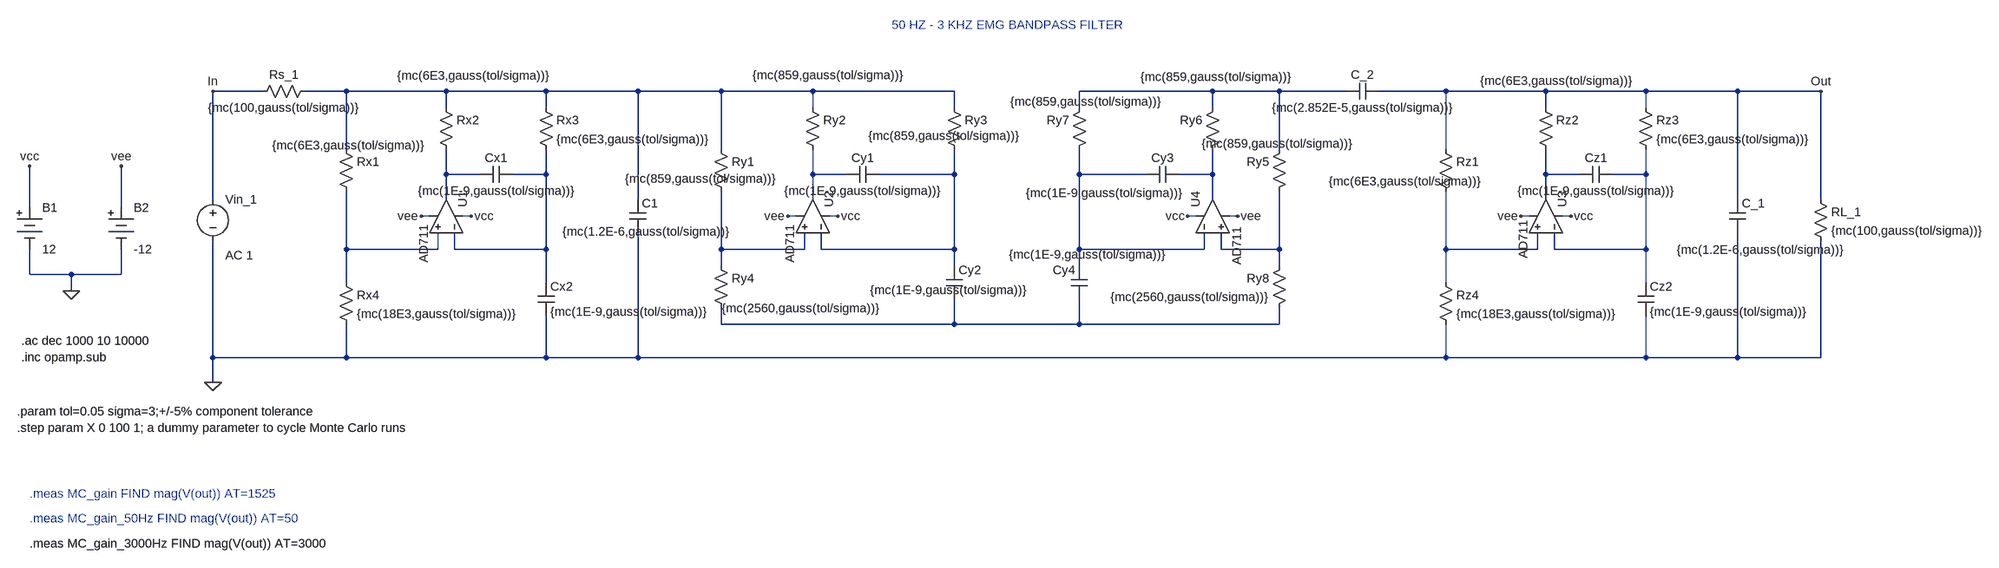
[diagram p0: schematic MC_FEMG.asc]
MC_FEMG.asc, the LTspice schematic file:
Version 4.1
SHEET 1 2276 824
WIRE -1072 -128 -1168 -128
WIRE -912 -128 -992 -128
WIRE -720 -128 -912 -128
WIRE -528 -128 -720 -128
WIRE -352 -128 -528 -128
WIRE -192 -128 -352 -128
WIRE -16 -128 -192 -128
WIRE 256 -128 -16 -128
WIRE 752 -128 496 -128
WIRE 880 -128 752 -128
WIRE 1008 -128 880 -128
WIRE 1200 -128 1072 -128
WIRE 1392 -128 1200 -128
WIRE 1584 -128 1392 -128
WIRE 1760 -128 1584 -128
WIRE 1920 -128 1760 -128
WIRE -720 -96 -720 -128
WIRE -528 -96 -528 -128
WIRE -16 -96 -16 -128
WIRE 256 -96 256 -128
WIRE 496 -96 496 -128
WIRE 752 -96 752 -128
WIRE 1392 -96 1392 -128
WIRE 1584 -96 1584 -128
WIRE -912 -16 -912 -128
WIRE -192 -16 -192 -128
WIRE 880 -16 880 -128
WIRE 1200 -16 1200 -128
WIRE -720 32 -720 -16
WIRE -656 32 -720 32
WIRE -528 32 -528 -16
WIRE -528 32 -592 32
WIRE -16 32 -16 -16
WIRE 48 32 -16 32
WIRE 256 32 256 -16
WIRE 256 32 112 32
WIRE 496 32 496 -16
WIRE 624 32 496 32
WIRE 752 32 752 -16
WIRE 752 32 688 32
WIRE 1392 32 1392 -16
WIRE 1456 32 1392 32
WIRE 1584 32 1584 -16
WIRE 1584 32 1520 32
WIRE -1168 80 -1168 -128
WIRE -720 80 -720 32
WIRE -352 80 -352 -128
WIRE -16 80 -16 32
WIRE 752 80 752 32
WIRE 1392 80 1392 32
WIRE 1760 80 1760 -128
WIRE 1920 80 1920 -128
WIRE -1520 96 -1520 16
WIRE -1344 96 -1344 16
WIRE -752 112 -768 112
WIRE -672 112 -688 112
WIRE -48 112 -64 112
WIRE 32 112 16 112
WIRE 720 112 704 112
WIRE 800 112 784 112
WIRE 1360 112 1344 112
WIRE 1440 112 1424 112
WIRE -912 176 -912 64
WIRE -736 176 -736 144
WIRE -736 176 -912 176
WIRE -704 176 -704 144
WIRE -528 176 -528 32
WIRE -528 176 -704 176
WIRE -192 176 -192 64
WIRE -32 176 -32 144
WIRE -32 176 -192 176
WIRE 0 176 0 144
WIRE 256 176 256 32
WIRE 256 176 0 176
WIRE 496 176 496 32
WIRE 736 176 736 144
WIRE 736 176 496 176
WIRE 768 176 768 144
WIRE 880 176 880 64
WIRE 880 176 768 176
WIRE 1200 176 1200 64
WIRE 1376 176 1376 144
WIRE 1376 176 1200 176
WIRE 1408 176 1408 144
WIRE 1584 176 1584 32
WIRE 1584 176 1408 176
WIRE -192 208 -192 176
WIRE 256 208 256 176
WIRE 496 208 496 176
WIRE 880 208 880 176
WIRE -1520 224 -1520 176
WIRE -1440 224 -1520 224
WIRE -1344 224 -1344 176
WIRE -1344 224 -1440 224
WIRE -912 240 -912 176
WIRE -528 240 -528 176
WIRE 1200 240 1200 176
WIRE 1584 240 1584 176
WIRE -1440 256 -1440 224
WIRE -192 320 -192 288
WIRE 256 320 256 272
WIRE 256 320 -192 320
WIRE 496 320 496 272
WIRE 496 320 256 320
WIRE 880 320 880 288
WIRE 880 320 496 320
WIRE -1168 384 -1168 160
WIRE -912 384 -912 320
WIRE -912 384 -1168 384
WIRE -528 384 -528 304
WIRE -528 384 -912 384
WIRE -352 384 -352 144
WIRE -352 384 -528 384
WIRE 1200 384 1200 320
WIRE 1200 384 -352 384
WIRE 1584 384 1584 304
WIRE 1584 384 1200 384
WIRE 1760 384 1760 144
WIRE 1760 384 1584 384
WIRE 1920 384 1920 160
WIRE 1920 384 1760 384
WIRE -1168 432 -1168 384
FLAG -1168 432 0
FLAG -1440 256 0
FLAG -1520 16 vcc
FLAG -1344 16 vee
FLAG -768 112 vee
FLAG -64 112 vee
FLAG 800 112 vee
FLAG 1344 112 vee
FLAG -672 112 vcc
FLAG 32 112 vcc
FLAG 704 112 vcc
FLAG 1440 112 vcc
FLAG -1168 -128 In
FLAG 1920 -128 Out
SYMBOL voltage -1168 64 R0
WINDOW 123 24 124 Left 2
WINDOW 39 0 0 Left 0
SYMATTR Value2 AC 1
SYMATTR InstName Vin_1
SYMATTR Value ""
SYMBOL res -976 -144 R90
WINDOW 0 0 56 VBottom 2
WINDOW 3 32 56 VTop 2
SYMATTR InstName Rs_1
SYMATTR Value {mc(100,gauss(tol/sigma))}
SYMBOL res -928 -32 R0
WINDOW 3 -126 8 Left 2
SYMATTR Value {mc(6E3,gauss(tol/sigma))}
SYMATTR InstName Rx1
SYMBOL res -736 -112 R0
WINDOW 3 -78 -46 Left 2
SYMATTR Value {mc(6E3,gauss(tol/sigma))}
SYMATTR InstName Rx2
SYMBOL res -544 -112 R0
SYMATTR InstName Rx3
SYMATTR Value {mc(6E3,gauss(tol/sigma))}
SYMBOL cap -592 16 R90
WINDOW 0 0 32 VBottom 2
WINDOW 3 32 32 VTop 2
SYMATTR InstName Cx1
SYMATTR Value {mc(1E-9,gauss(tol/sigma))}
SYMBOL res -928 224 R0
SYMATTR InstName Rx4
SYMATTR Value {mc(18E3,gauss(tol/sigma))}
SYMBOL cap -544 240 R0
SYMATTR InstName Cx2
SYMATTR Value {mc(1E-9,gauss(tol/sigma))}
SYMBOL cap -368 80 R0
WINDOW 3 -129 62 Left 2
SYMATTR Value {mc(1.2E-6,gauss(tol/sigma))}
SYMATTR InstName C1
SYMBOL res -208 -32 R0
WINDOW 3 -169 72 Left 2
SYMATTR Value {mc(859,gauss(tol/sigma))}
SYMATTR InstName Ry1
SYMBOL res -32 -112 R0
WINDOW 3 -100 -47 Left 2
SYMATTR Value {mc(859,gauss(tol/sigma))}
SYMATTR InstName Ry2
SYMBOL res 240 -112 R0
WINDOW 3 -149 70 Left 2
SYMATTR Value {mc(859,gauss(tol/sigma))}
SYMATTR InstName Ry3
SYMBOL cap 112 16 R90
WINDOW 0 0 32 VBottom 2
WINDOW 3 32 32 VTop 2
SYMATTR InstName Cy1
SYMATTR Value {mc(1E-9,gauss(tol/sigma))}
SYMBOL res -208 192 R0
WINDOW 3 17 97 Left 2
SYMATTR Value {mc(2560,gauss(tol/sigma))}
SYMATTR InstName Ry4
SYMBOL cap 240 208 R0
WINDOW 3 -146 46 Left 2
SYMATTR Value {mc(1E-9,gauss(tol/sigma))}
SYMATTR InstName Cy2
SYMBOL res 896 -32 M0
WINDOW 3 -125 5 Left 2
SYMATTR Value {mc(859,gauss(tol/sigma))}
SYMATTR InstName Ry5
SYMBOL res 768 -112 M0
WINDOW 3 -136 -44 Left 2
SYMATTR Value {mc(859,gauss(tol/sigma))}
SYMATTR InstName Ry6
SYMBOL res 512 -112 M0
WINDOW 3 -142 4 Left 2
SYMATTR Value {mc(859,gauss(tol/sigma))}
SYMATTR InstName Ry7
SYMBOL cap 624 16 M90
WINDOW 0 0 32 VBottom 2
WINDOW 3 36 -80 VTop 2
SYMATTR InstName Cy3
SYMATTR Value {mc(1E-9,gauss(tol/sigma))}
SYMBOL res 896 192 M0
SYMATTR InstName Ry8
SYMATTR Value {mc(2560,gauss(tol/sigma))}
SYMBOL cap 512 208 M0
WINDOW 3 -150 -22 Left 2
SYMATTR Value {mc(1E-9,gauss(tol/sigma))}
SYMATTR InstName Cy4
SYMBOL res 1184 -32 R0
WINDOW 3 -209 77 Left 2
SYMATTR Value {mc(6E3,gauss(tol/sigma))}
SYMATTR InstName Rz1
SYMBOL res 1376 -112 R0
WINDOW 3 -110 -36 Left 2
SYMATTR Value {mc(6E3,gauss(tol/sigma))}
SYMATTR InstName Rz2
SYMBOL res 1568 -112 R0
SYMATTR InstName Rz3
SYMATTR Value {mc(6E3,gauss(tol/sigma))}
SYMBOL cap 1520 16 R90
WINDOW 0 0 32 VBottom 2
WINDOW 3 32 32 VTop 2
SYMATTR InstName Cz1
SYMATTR Value {mc(1E-9,gauss(tol/sigma))}
SYMBOL res 1184 224 R0
SYMATTR InstName Rz4
SYMATTR Value {mc(18E3,gauss(tol/sigma))}
SYMBOL cap 1568 240 R0
SYMATTR InstName Cz2
SYMATTR Value {mc(1E-9,gauss(tol/sigma))}
SYMBOL cap 1744 80 R0
WINDOW 3 -101 97 Left 2
SYMATTR Value {mc(1.2E-6,gauss(tol/sigma))}
SYMATTR InstName C_1
SYMBOL cap 1072 -144 R90
WINDOW 0 0 32 VBottom 2
WINDOW 3 32 32 VTop 2
SYMATTR InstName C_2
SYMATTR Value {mc(2.852E-5,gauss(tol/sigma))}
SYMBOL res 1904 64 R0
SYMATTR InstName RL_1
SYMATTR Value {mc(100,gauss(tol/sigma))}
SYMBOL OpAmps\\AD711 -656 112 M270
WINDOW 3 -90 107 Left 2
SYMATTR InstName U1
SYMBOL OpAmps\\AD711 48 112 M270
WINDOW 3 -90 107 Left 2
SYMATTR InstName U2
SYMBOL OpAmps\\AD711 1456 112 M270
WINDOW 3 -82 107 Left 2
SYMATTR InstName U3
SYMBOL OpAmps\\AD711 688 112 R270
WINDOW 3 -94 111 Left 2
SYMATTR InstName U4
SYMBOL Misc\\battery -1520 80 R0
SYMATTR InstName B1
SYMATTR Value 12
SYMBOL Misc\\battery -1344 80 R0
SYMATTR InstName B2
SYMATTR Value -12
TEXT 136 -256 Left 2 ;50 HZ - 3 KHZ EMG BANDPASS FILTER
TEXT -1536 352 Left 2 !.ac dec 1000 10 10000\n.inc opamp.sub
TEXT -1544 488 Left 2 !.param tol=0.05 sigma=3;+/-5% component tolerance\n.step param X 0 100 1; a dummy parameter to cycle Monte Carlo runs
TEXT -1520 664 Left 2 ;.meas MC_gain FIND mag(V(out)) AT=1525
TEXT -1520 712 Left 2 ;.meas MC_gain_50Hz FIND mag(V(out)) AT=50
TEXT -1520 760 Left 2 !.meas MC_gain_3000Hz FIND mag(V(out)) AT=3000

The netlist it stands for:
* MC_FEMG.asc
Vin_1 In 0 AC 1
Rs_1 N001 In {mc(100,gauss(tol/sigma))}
Rx1 N001 N011 {mc(6E3,gauss(tol/sigma))}
Rx2 N001 N003 {mc(6E3,gauss(tol/sigma))}
Rx3 N001 N004 {mc(6E3,gauss(tol/sigma))}
Cx1 N004 N003 {mc(1E-9,gauss(tol/sigma))}
Rx4 N011 0 {mc(18E3,gauss(tol/sigma))}
Cx2 N004 0 {mc(1E-9,gauss(tol/sigma))}
C1 N001 0 {mc(1.2E-6,gauss(tol/sigma))}
Ry1 N001 N012 {mc(859,gauss(tol/sigma))}
Ry2 N001 N005 {mc(859,gauss(tol/sigma))}
Ry3 N001 N006 {mc(859,gauss(tol/sigma))}
Cy1 N006 N005 {mc(1E-9,gauss(tol/sigma))}
Ry4 N012 N015 {mc(2560,gauss(tol/sigma))}
Cy2 N006 N015 {mc(1E-9,gauss(tol/sigma))}
Ry5 N002 N013 {mc(859,gauss(tol/sigma))}
Ry6 N002 N008 {mc(859,gauss(tol/sigma))}
Ry7 N002 N007 {mc(859,gauss(tol/sigma))}
Cy3 N007 N008 {mc(1E-9,gauss(tol/sigma))}
Ry8 N013 N015 {mc(2560,gauss(tol/sigma))}
Cy4 N007 N015 {mc(1E-9,gauss(tol/sigma))}
Rz1 Out N014 {mc(6E3,gauss(tol/sigma))}
Rz2 Out N009 {mc(6E3,gauss(tol/sigma))}
Rz3 Out N010 {mc(6E3,gauss(tol/sigma))}
Cz1 N010 N009 {mc(1E-9,gauss(tol/sigma))}
Rz4 N014 0 {mc(18E3,gauss(tol/sigma))}
Cz2 N010 0 {mc(1E-9,gauss(tol/sigma))}
C_1 Out 0 {mc(1.2E-6,gauss(tol/sigma))}
C_2 Out N002 {mc(2.852E-5,gauss(tol/sigma))}
RL_1 Out 0 {mc(100,gauss(tol/sigma))}
X§U1 N011 N004 vcc vee N003 AD712  ; AD711, pins In+ In- V+ V- OUT
X§U2 N012 N006 vcc vee N005 AD712  ; AD711, pins In+ In- V+ V- OUT
X§U3 N014 N010 vcc vee N009 AD712  ; AD711, pins In+ In- V+ V- OUT
X§U4 N013 N007 vcc vee N008 AD712  ; AD711, pins In+ In- V+ V- OUT
V§B1 vcc 0 12
V§B2 vee 0 -12
* 50 HZ - 3 KHZ EMG BANDPASS FILTER
.ac dec 1000 10 10000
.inc opamp.sub
.param tol=0.05 sigma=3;+/-5% component tolerance
.step param X 0 100 1; a dummy parameter to cycle Monte Carlo runs
* .meas MC_gain FIND mag(V(out)) AT=1525
* .meas MC_gain_50Hz FIND mag(V(out)) AT=50
.meas MC_gain_3000Hz FIND mag(V(out)) AT=3000
.lib ADI1.lib
.backanno
.end